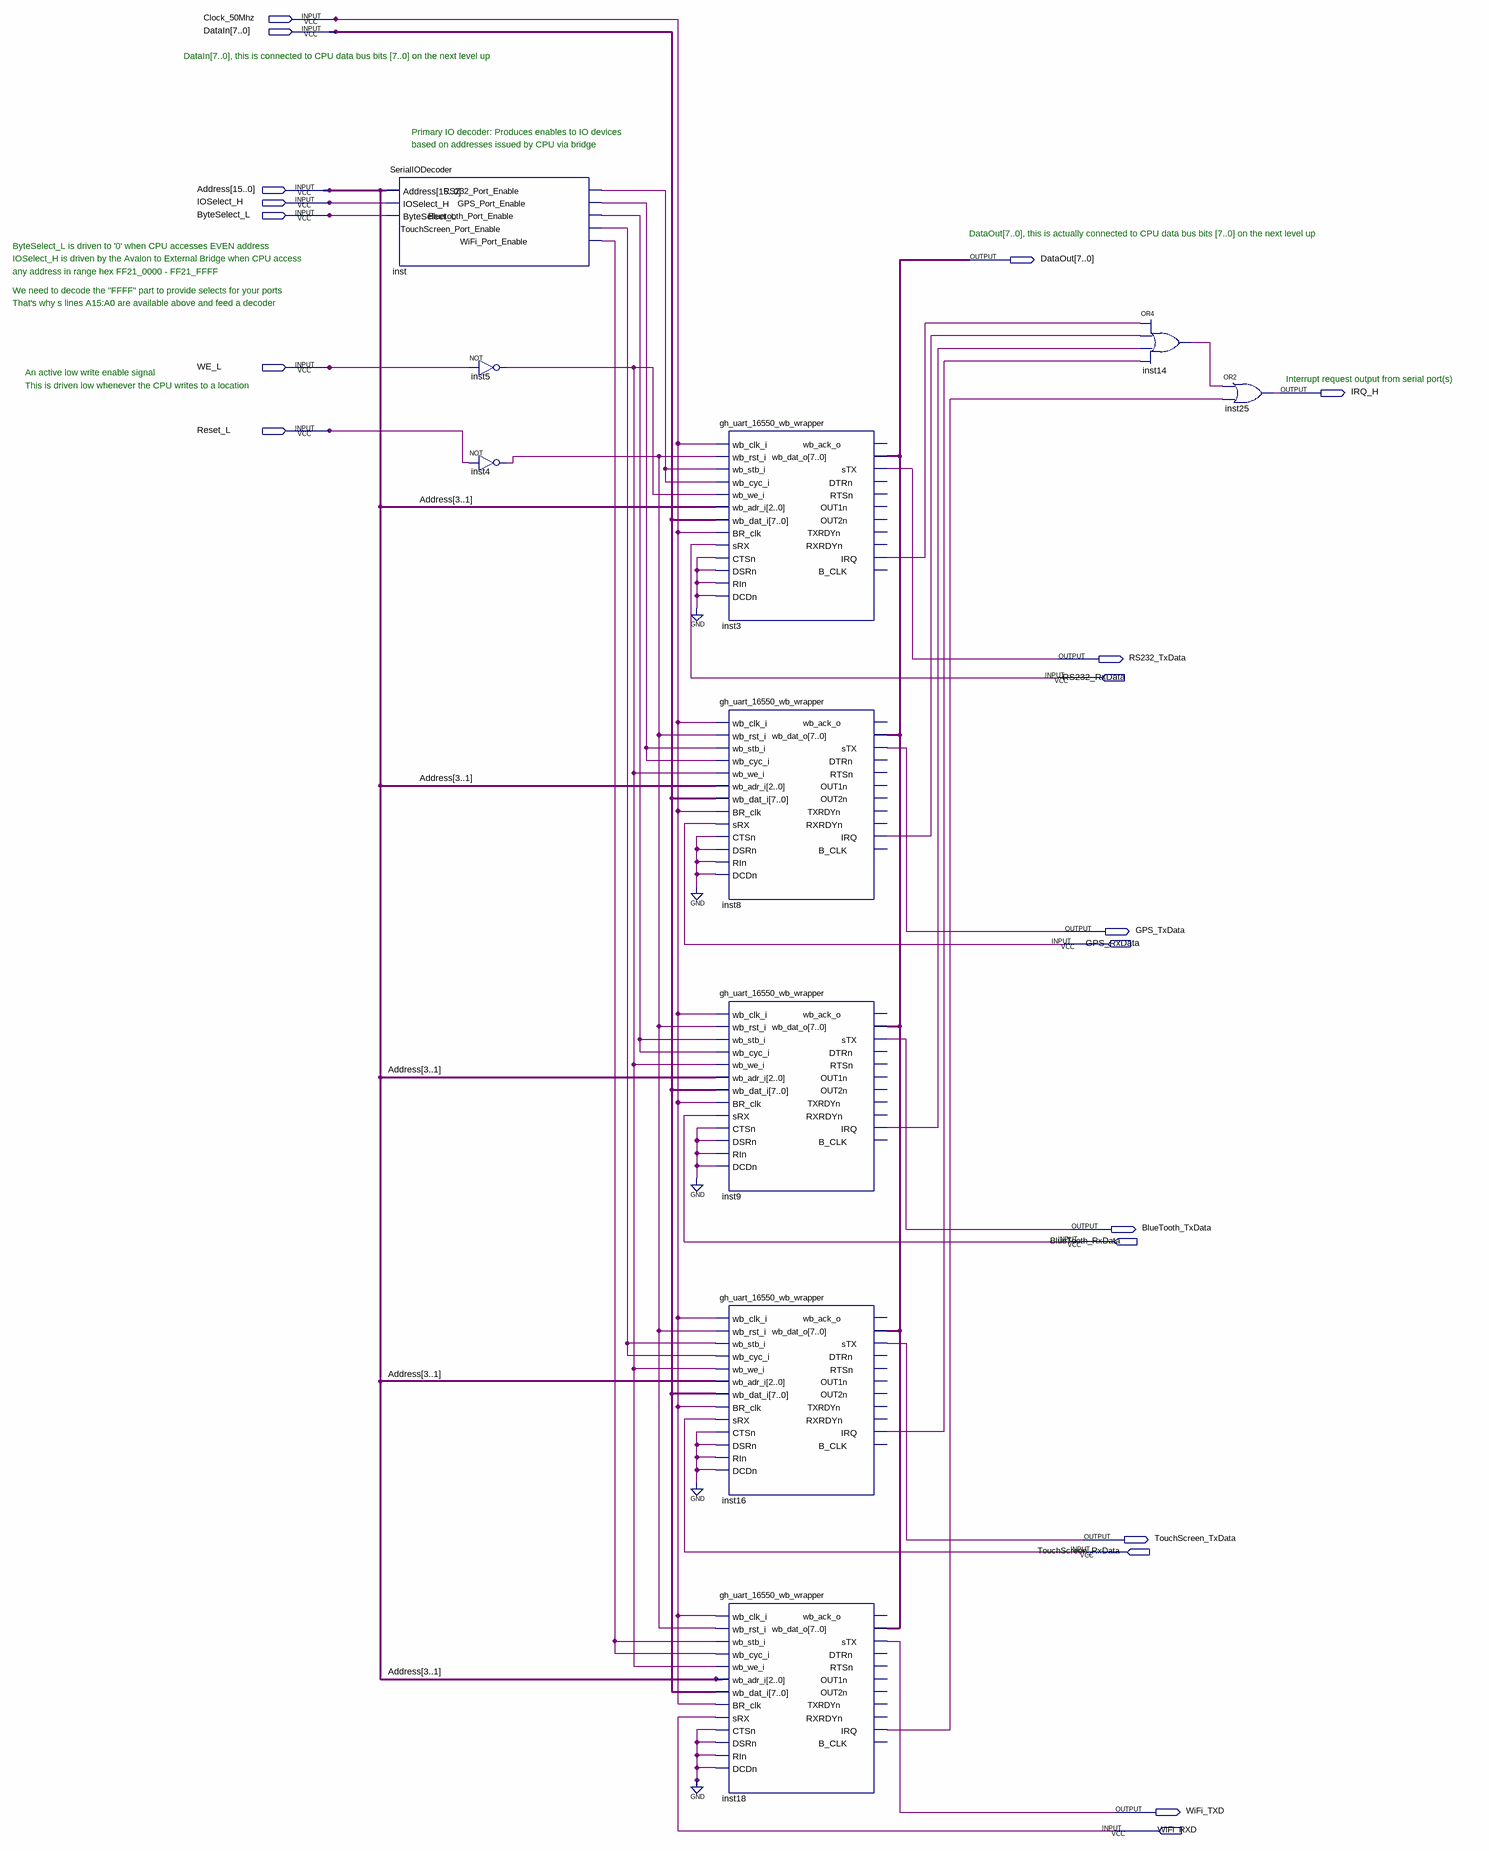
[diagram p0: schematic sheet]
// Quartus schematic OnChipSerialIO.bdf as structural Verilog: 10 symbols, 19 pins
module OnChipSerialIO (
  input  Clock_50Mhz,
  input  [7:0] DataIn,
  input  [15:0] Address,
  input  IOSelect_H,
  input  ByteSelect_L,
  input  WE_L,
  input  Reset_L,
  input  RS232_RxData,
  input  GPS_RxData,
  input  BlueTooth_RxData,
  input  TouchScreen_RxData,
  input  WiFi_RXD,
  output [7:0] DataOut,
  output IRQ_H,
  output RS232_TxData,
  output GPS_TxData,
  output BlueTooth_TxData,
  output TouchScreen_TxData,
  output WiFi_TXD
);

  wire inst3_irq, inst4_out, inst5_out, inst8_irq, inst9_irq, inst14_out, inst16_irq, inst18_irq,
       inst_bluetooth_port_enable, inst_gps_port_enable, inst_rs232_port_enable,
       inst_touchscreen_port_enable, inst_wifi_port_enable;

  SerialIODecoder inst (
    .Address(Address), .IOSelect_H(IOSelect_H), .ByteSelect_L(ByteSelect_L),
    .RS232_Port_Enable(inst_rs232_port_enable), .GPS_Port_Enable(inst_gps_port_enable),
    .Bluetooth_Port_Enable(inst_bluetooth_port_enable),
    .TouchScreen_Port_Enable(inst_touchscreen_port_enable), .WiFi_Port_Enable(inst_wifi_port_enable));
  not inst5 (inst5_out, WE_L);
  not inst4 (inst4_out, Reset_L);
  gh_uart_16550_wb_wrapper inst3 (
    .wb_clk_i(Clock_50Mhz), .wb_rst_i(inst4_out), .wb_stb_i(inst_rs232_port_enable),
    .wb_cyc_i(inst_rs232_port_enable), .wb_we_i(inst5_out), .wb_adr_i(Address[3:1]), .wb_dat_i(DataIn),
    .BR_clk(Clock_50Mhz), .sRX(RS232_RxData), .CTSn(1'b0), .DSRn(1'b0), .RIn(1'b0), .DCDn(1'b0),
    .wb_dat_o(DataOut), .sTX(RS232_TxData), .IRQ(inst3_irq));  // open: wb_ack_o, DTRn, RTSn, OUT1n, OUT2n, TXRDYn, RXRDYn, B_CLK
  gh_uart_16550_wb_wrapper inst8 (
    .wb_clk_i(Clock_50Mhz), .wb_rst_i(inst4_out), .wb_stb_i(inst_gps_port_enable),
    .wb_cyc_i(inst_gps_port_enable), .wb_we_i(inst5_out), .wb_adr_i(Address[3:1]), .wb_dat_i(DataIn),
    .BR_clk(Clock_50Mhz), .sRX(GPS_RxData), .CTSn(1'b0), .DSRn(1'b0), .RIn(1'b0), .DCDn(1'b0),
    .wb_dat_o(DataOut), .sTX(GPS_TxData), .IRQ(inst8_irq));  // open: wb_ack_o, DTRn, RTSn, OUT1n, OUT2n, TXRDYn, RXRDYn, B_CLK
  gh_uart_16550_wb_wrapper inst9 (
    .wb_clk_i(Clock_50Mhz), .wb_rst_i(inst4_out), .wb_stb_i(inst_bluetooth_port_enable),
    .wb_cyc_i(inst_bluetooth_port_enable), .wb_we_i(inst5_out), .wb_adr_i(Address[3:1]), .wb_dat_i(DataIn),
    .BR_clk(Clock_50Mhz), .sRX(BlueTooth_RxData), .CTSn(1'b0), .DSRn(1'b0), .RIn(1'b0), .DCDn(1'b0),
    .wb_dat_o(DataOut), .sTX(BlueTooth_TxData), .IRQ(inst9_irq));  // open: wb_ack_o, DTRn, RTSn, OUT1n, OUT2n, TXRDYn, RXRDYn, B_CLK
  gh_uart_16550_wb_wrapper inst16 (
    .wb_clk_i(Clock_50Mhz), .wb_rst_i(inst4_out), .wb_stb_i(inst_touchscreen_port_enable),
    .wb_cyc_i(inst_touchscreen_port_enable), .wb_we_i(inst5_out), .wb_adr_i(Address[3:1]), .wb_dat_i(DataIn),
    .BR_clk(Clock_50Mhz), .sRX(TouchScreen_RxData), .CTSn(1'b0), .DSRn(1'b0), .RIn(1'b0), .DCDn(1'b0),
    .wb_dat_o(DataOut), .sTX(TouchScreen_TxData), .IRQ(inst16_irq));  // open: wb_ack_o, DTRn, RTSn, OUT1n, OUT2n, TXRDYn, RXRDYn, B_CLK
  gh_uart_16550_wb_wrapper inst18 (
    .wb_clk_i(Clock_50Mhz), .wb_rst_i(inst4_out), .wb_stb_i(inst_wifi_port_enable),
    .wb_cyc_i(inst_wifi_port_enable), .wb_we_i(inst5_out), .wb_adr_i(Address[3:1]), .wb_dat_i(DataIn),
    .BR_clk(Clock_50Mhz), .sRX(WiFi_RXD), .CTSn(1'b0), .DSRn(1'b0), .RIn(1'b0), .DCDn(1'b0),
    .wb_dat_o(DataOut), .sTX(WiFi_TXD), .IRQ(inst18_irq));  // open: wb_ack_o, DTRn, RTSn, OUT1n, OUT2n, TXRDYn, RXRDYn, B_CLK
  or inst14 (inst14_out, inst3_irq, inst8_irq, inst9_irq, inst16_irq);
  or inst25 (IRQ_H, inst14_out, inst18_irq);

  // Notes on the sheet:
  //   DataIn[7..0], this is connected to CPU data bus bits [7..0] on the next level up
  //   Primary IO decoder: Produces enables to IO devices
  //   based on addresses issued by CPU via bridge
  //   DataOut[7..0], this is actually connected to CPU data bus bits [7..0] on the next level up
  //   ByteSelect_L is driven to '0' when CPU accesses EVEN address
  //   IOSelect_H is driven by the Avalon to External Bridge when CPU access
  //   any address in range hex FF21_0000 - FF21_FFFF
  //   We need to decode the "FFFF" part to provide selects for your ports 
  //   That's why s lines A15:A0 are available above and feed a decoder
  //   An active low write enable signal
  //   Interrupt request output from serial port(s)
  //   This is driven low whenever the CPU writes to a location
endmodule
